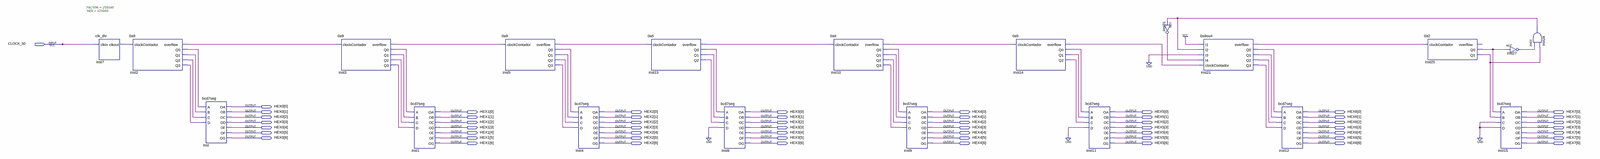
[diagram p0: schematic sheet, whole]
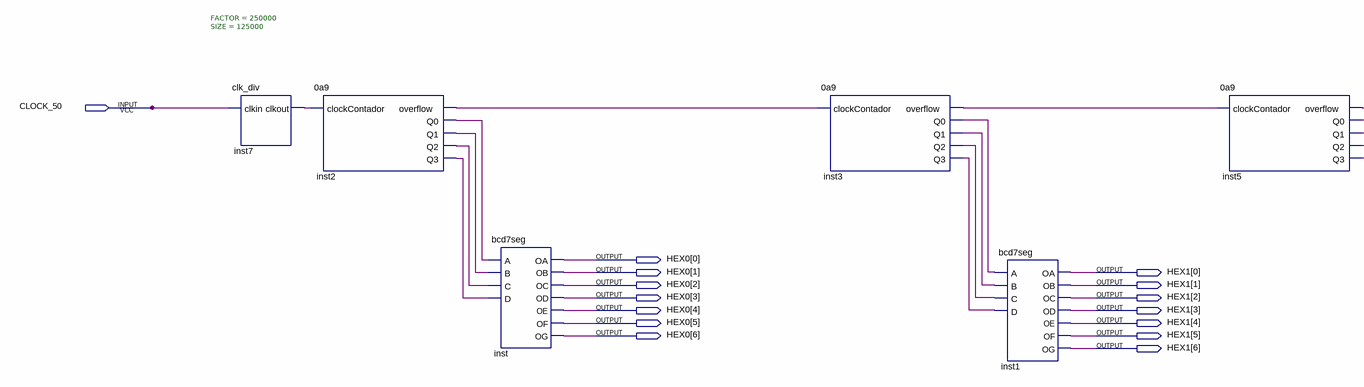
[diagram p1: schematic sheet, left part]
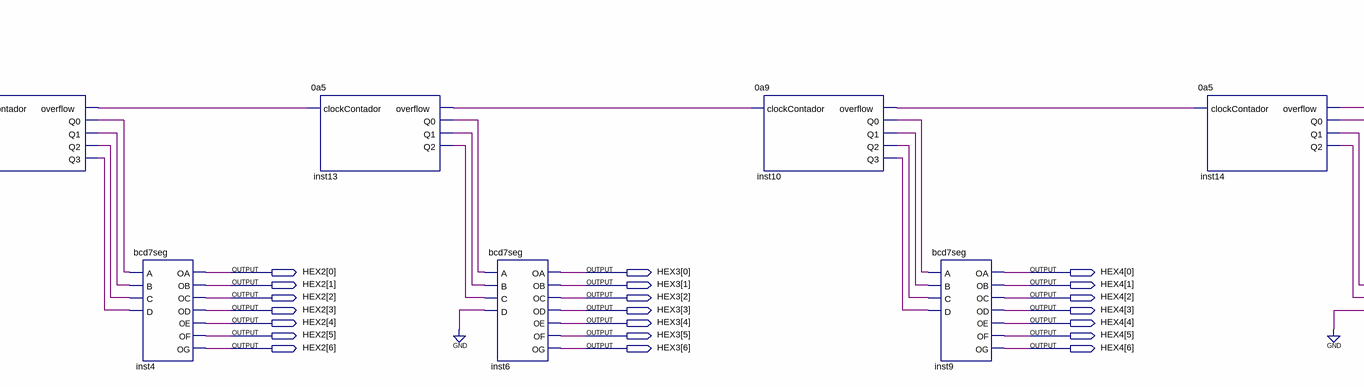
[diagram p2: schematic sheet, centre part]
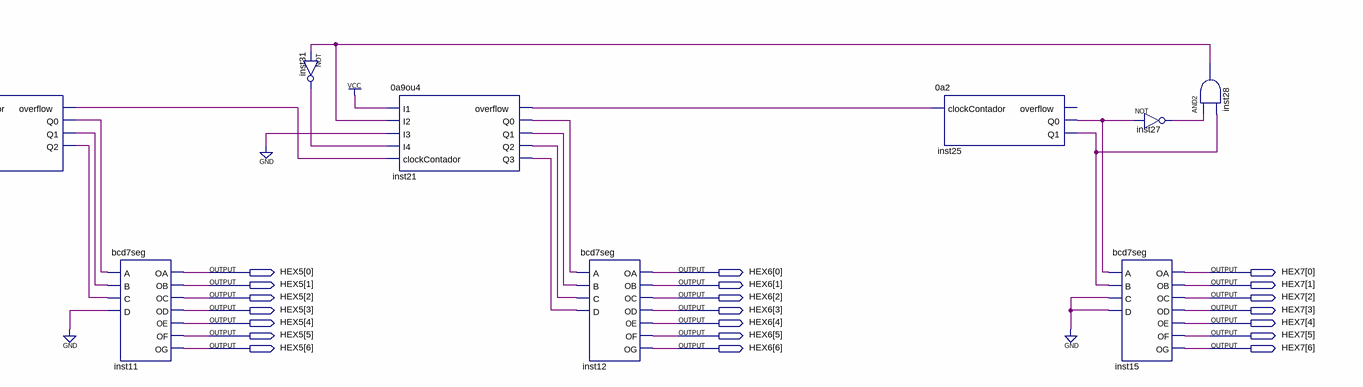
[diagram p3: schematic sheet, right part]
// Quartus schematic toplevel.bdf as structural Verilog: 20 symbols, 57 pins
module toplevel (
  input  CLOCK_50,
  output [6:0] HEX0,
  output [6:0] HEX1,
  output [6:0] HEX2,
  output [6:0] HEX3,
  output [6:0] HEX4,
  output [6:0] HEX5,
  output [6:0] HEX6,
  output [6:0] HEX7
);

  wire inst2_overflow, inst2_q0, inst2_q1, inst2_q2, inst2_q3, inst3_overflow, inst3_q0, inst3_q1, inst3_q2,
       inst3_q3, inst5_overflow, inst5_q0, inst5_q1, inst5_q2, inst5_q3, inst7_clkout, inst10_overflow,
       inst10_q0, inst10_q1, inst10_q2, inst10_q3, inst13_overflow, inst13_q0, inst13_q1, inst13_q2,
       inst14_overflow, inst14_q0, inst14_q1, inst14_q2, inst21_overflow, inst21_q0, inst21_q1, inst21_q2,
       inst21_q3, inst25_q0, inst25_q1, inst27_out, inst28_out, inst31_out;

  clk_div #(.FACTOR(250000), .SIZE(125000)) inst7 (.clkin(CLOCK_50), .clkout(inst7_clkout));
  \0a9  inst2 (
    .clockContador(inst7_clkout), .overflow(inst2_overflow), .Q0(inst2_q0), .Q1(inst2_q1), .Q2(inst2_q2),
    .Q3(inst2_q3));
  bcd7seg inst (
    .A(inst2_q0), .B(inst2_q1), .C(inst2_q2), .D(inst2_q3), .OA(HEX0[0]), .OB(HEX0[1]), .OC(HEX0[2]),
    .OD(HEX0[3]), .OE(HEX0[4]), .OF(HEX0[5]), .OG(HEX0[6]));
  \0a9  inst3 (
    .clockContador(inst2_overflow), .overflow(inst3_overflow), .Q0(inst3_q0), .Q1(inst3_q1), .Q2(inst3_q2),
    .Q3(inst3_q3));
  bcd7seg inst1 (
    .A(inst3_q0), .B(inst3_q1), .C(inst3_q2), .D(inst3_q3), .OA(HEX1[0]), .OB(HEX1[1]), .OC(HEX1[2]),
    .OD(HEX1[3]), .OE(HEX1[4]), .OF(HEX1[5]), .OG(HEX1[6]));
  \0a9  inst5 (
    .clockContador(inst3_overflow), .overflow(inst5_overflow), .Q0(inst5_q0), .Q1(inst5_q1), .Q2(inst5_q2),
    .Q3(inst5_q3));
  bcd7seg inst4 (
    .A(inst5_q0), .B(inst5_q1), .C(inst5_q2), .D(inst5_q3), .OA(HEX2[0]), .OB(HEX2[1]), .OC(HEX2[2]),
    .OD(HEX2[3]), .OE(HEX2[4]), .OF(HEX2[5]), .OG(HEX2[6]));
  \0a5  inst13 (
    .clockContador(inst5_overflow), .overflow(inst13_overflow), .Q0(inst13_q0), .Q1(inst13_q1), .Q2(inst13_q2));
  bcd7seg inst6 (
    .A(inst13_q0), .B(inst13_q1), .C(inst13_q2), .D(1'b0), .OA(HEX3[0]), .OB(HEX3[1]), .OC(HEX3[2]),
    .OD(HEX3[3]), .OE(HEX3[4]), .OF(HEX3[5]), .OG(HEX3[6]));
  \0a9  inst10 (
    .clockContador(inst13_overflow), .overflow(inst10_overflow), .Q0(inst10_q0), .Q1(inst10_q1),
    .Q2(inst10_q2), .Q3(inst10_q3));
  bcd7seg inst9 (
    .A(inst10_q0), .B(inst10_q1), .C(inst10_q2), .D(inst10_q3), .OA(HEX4[0]), .OB(HEX4[1]), .OC(HEX4[2]),
    .OD(HEX4[3]), .OE(HEX4[4]), .OF(HEX4[5]), .OG(HEX4[6]));
  \0a5  inst14 (
    .clockContador(inst10_overflow), .overflow(inst14_overflow), .Q0(inst14_q0), .Q1(inst14_q1),
    .Q2(inst14_q2));
  bcd7seg inst11 (
    .A(inst14_q0), .B(inst14_q1), .C(inst14_q2), .D(1'b0), .OA(HEX5[0]), .OB(HEX5[1]), .OC(HEX5[2]),
    .OD(HEX5[3]), .OE(HEX5[4]), .OF(HEX5[5]), .OG(HEX5[6]));
  not inst31 (inst31_out, inst28_out);
  \0a9ou4  inst21 (
    .I1(1'b1), .I2(inst28_out), .I3(1'b0), .I4(inst31_out), .clockContador(inst14_overflow),
    .overflow(inst21_overflow), .Q0(inst21_q0), .Q1(inst21_q1), .Q2(inst21_q2), .Q3(inst21_q3));
  bcd7seg inst12 (
    .A(inst21_q0), .B(inst21_q1), .C(inst21_q2), .D(inst21_q3), .OA(HEX6[0]), .OB(HEX6[1]), .OC(HEX6[2]),
    .OD(HEX6[3]), .OE(HEX6[4]), .OF(HEX6[5]), .OG(HEX6[6]));
  \0a2  inst25 (.clockContador(inst21_overflow), .Q0(inst25_q0), .Q1(inst25_q1));  // open: overflow
  not inst27 (inst27_out, inst25_q0);
  bcd7seg inst15 (
    .A(inst25_q0), .B(inst25_q1), .C(1'b0), .D(1'b0), .OA(HEX7[0]), .OB(HEX7[1]), .OC(HEX7[2]), .OD(HEX7[3]),
    .OE(HEX7[4]), .OF(HEX7[5]), .OG(HEX7[6]));
  and inst28 (inst28_out, inst27_out, inst25_q1);
endmodule
